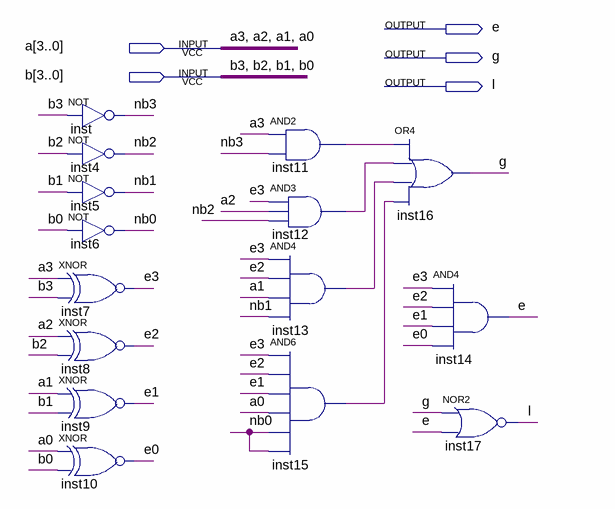
[diagram p0: schematic sheet]
// Quartus schematic s27_4cmp.bdf as structural Verilog: 15 symbols, 5 pins
module s27_4cmp (
  input  [3:0] a,
  input  [3:0] b,
  output e,
  output g,
  output l
);

  wire e0, e1, e2, e3, inst11_out, inst12_out, inst13_out, inst15_out, nb0, nb1, nb2, nb3;

  not inst (nb3, b[3]);
  not inst4 (nb2, b[2]);
  not inst5 (nb1, b[1]);
  not inst6 (nb0, b[0]);
  xnor inst7 (e3, a[3], b[3]);
  xnor inst8 (e2, a[2], b[2]);
  xnor inst9 (e1, a[1], b[1]);
  xnor inst10 (e0, a[0], b[0]);
  and inst11 (inst11_out, a[3], nb3);
  and inst12 (inst12_out, e3, a[2], nb2);
  and inst13 (inst13_out, e3, e2, a[1], nb1);
  and inst15 (inst15_out, e3, e2, e1, a[0], nb0, nb0);
  or inst16 (g, inst11_out, inst12_out, inst13_out, inst15_out);
  and inst14 (e, e3, e2, e1, e0);
  nor inst17 (l, g, e);
endmodule
